# EAGLE design Side_1P (EAGLE 9.6.2)
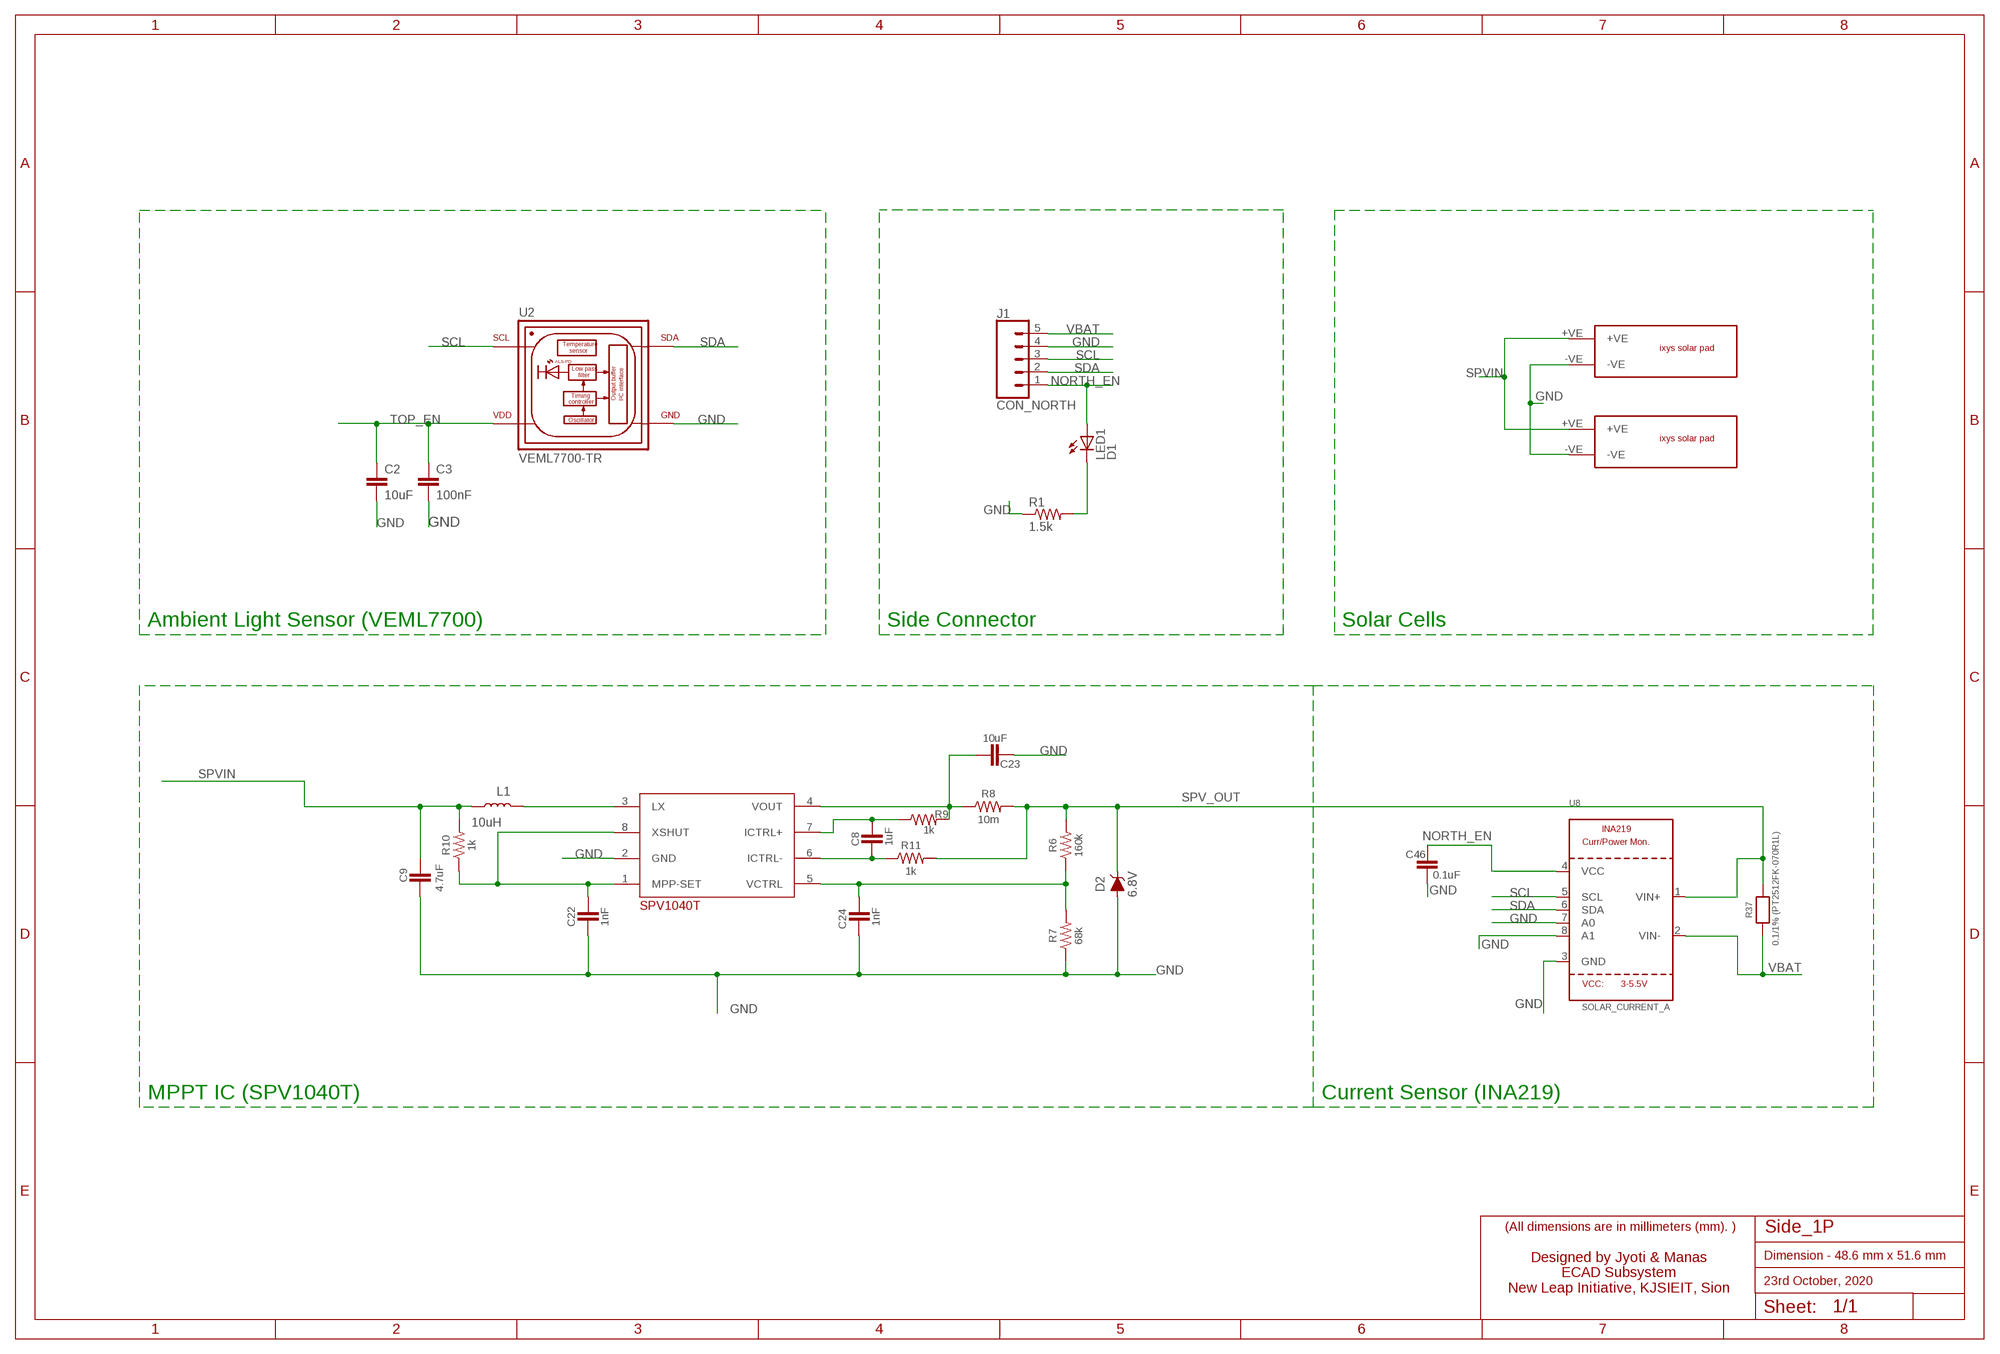
[diagram p0: schematic, sheet 1]

## Parts
C2  10uF  2.2NF/2200PF-0603-50V-10%  [0603]
C3  100nF  2.2NF/2200PF-0603-50V-10%  [0603]
C8  1uF  10UF-0603-6.3V-20%  [0603]
C9  4.7uF  10UF-0603-6.3V-20%  [0603]
C22  1nF  10UF-0603-6.3V-20%  [0603]
C23  10uF  10UF-0603-6.3V-20%  [0603]
C24  1nF  10UF-0603-6.3V-20%  [0603]
C46  0.1uF  10UF-0603-6.3V-20%  [0603]
D2  6.8V  DIODE-ZENER-MMSZ5232BS  [SOD-323]
J1  CON_NORTH  CONN_051.27MM  [1X05_1.27MM]
L1  10uH  INDUCTOR-0603-33NH  [0603]
LED1  D1  LEDCHIP-LED0603  [CHIP-LED0603]
R1  1.5k  R-US_R0603  [R0603]
R6  160k  RC0603JR-070RL  [RES_0603]
R7  68k  RC0603JR-070RL  [RES_0603]
R8  10m  RC0603JR-070RL  [RES_0603]
R9  1k  RC0603JR-070RL  [RES_0603]
R10  1k  RC0603JR-070RL  [RES_0603]
R11  1k  RC0603JR-070RL  [RES_0603]
R37  0.1/1% (PT2512FK-070R1L)  RESISTOR2512  [2512]
SPV_A  SPV1040T_  [SOP65P640X120-8N]
U2  VEML7700-TR  [XDCR_VEML7700-TR]
U8  SOLAR_CURRENT_A  INA219  [SOT23-8]
U$1  IXYS  [IXYS]
U$2  IXYS  [IXYS]

## Nets
GND [vcc]: C2.2 C3.2 C9.2 C22.2 C23.2 C24.2 C46.2 D2.A J1.4 R1.1 R7.1 SPV_A.2(GND) U2.3(GND) U8.3(GND) U8.7(A0) U8.8(A1) U$1.-VE U$2.-VE
N$1: LED1.C R1.2
N$5: L1.2 SPV_A.3(LX)
N$31: C22.1 R10.1 SPV_A.1(MPP-SET) SPV_A.8(XSHUT)
N$32: C24.1 R6.1 R7.2 SPV_A.5(VCTRL)
N$34: C8.2 R11.1 SPV_A.6(ICTRL-)
N$35: C8.1 R9.1 SPV_A.7(ICTRL+)
N$36: C23.1 R8.1 R9.2 SPV_A.4(VOUT)
NORTH_EN: C46.1 J1.1 LED1.A U8.4(VCC)
SCL: J1.3 U2.1(SCL) U8.5(SCL)
SDA: J1.2 U2.4(SDA) U8.6(SDA)
SPV_OUT: D2.C R6.2 R8.2 R11.2 R37.2 U8.1(VIN+)
SPVIN: C9.1 L1.1 R10.2 U$1.+VE U$2.+VE
TOP_EN: C2.1 C3.1 U2.2(VDD)
VBAT: J1.5 R37.1 U8.2(VIN-)

## Notes on the sheet
- Ambient Light Sensor (VEML7700) | Side Connector | Solar Cells
- MPPT IC (SPV1040T) | Current Sensor (INA219)
- (All dimensions are in millimeters (mm). )
- Dimension - 48.6 mm x 51.6 mm
- Designed by Jyoti & Manas
  ECAD Subsystem
  New Leap Initiative, KJSIEIT, Sion
- 23rd October, 2020

## Library data of the parts
C2 C3 = SparkFun-Capacitors:2.2NF/2200PF: 2.2nF/2,200pF ceramic capacitors A capacitor is a passive two-terminal electrical component used to store electrical energy temporarily in an electric field.; PROD_ID: CAP-07877; VALUE: 2.2nF
C8 C9 C22 C24 C46 = SparkFun-Capacitors:10UF: 10.0µF ceramic capacitors A capacitor is a passive two-terminal electrical component used to store electrical energy temporarily in an electric field.; PROD_ID: CAP-11015; VALUE: 10uF
C23 = SparkFun-Capacitors:10UF: 10.0µF ceramic capacitors A capacitor is a passive two-terminal electrical component used to store electrical energy temporarily in an electric field.; PROD_ID: CAP-11015
D2 = SparkFun-DiscreteSemi:DIODE-ZENER: Zener Diode A Zener diode allows current to flow from its anode to its cathode like a normal semiconductor diode, but it also permits current to flow in the reverse direction when its "Zener voltage" is reached. - WIkipedia; PROD_ID: DIO-12442; VALUE: 5.6V
J1 = SparkFun-Connectors:CONN_05: Multi connection point. Often used as Generic Header-pin footprint for 0.1 inch spaced/style header connections On any of the 0.1 inch spaced packages, you can populate with these: Break Away Headers - Straight <https://www.sparkfun.com/products/116> (PRT-00116) Break Away Male Headers - Right Angle <https://www.sparkfun.com/products/553> (PRT-00553) Female Headers <https://www.sparkfun.com/products/115> (PRT-00115) Break Away Headers - Machine Pin <https://www.sparkfun.com/products/117> (PRT-00117) Break Away Female Headers - Swiss Machine Pin <https://www.sparkfun.com/products/743> (PRT-00743) For SCREWTERMINALS and SPRING TERMINALS visit here: Screw Terimnals on SparkFun.com <https://www.sparkfun.com/search/results?term=Screw+Terminals> (5mm/3.5mm/2.54mm spacing) This device is also useful as a general connection point to wire up your design to another part of your project. Our various solder wires solder well into these plated through hole pads. Hook-Up Wire - Assortment (Stranded, 22 AWG) <https://www.sparkfun.com/products/11375> (PRT-11375) Hook-Up Wire - Assortment (Solid Core, 22 AWG) <https://www.sparkfun.com/products/11367> (PRT-11367) View the entire wire category on our website here <https://www.sparkfun.com/categories/141> Special notes: Molex polarized connector foot print use with SKU : PRT-08231 with associated crimp pins and housings. 1MM SMD Version SKU: PRT-10208
L1 = SparkFun-Coils:INDUCTOR: Inductors Resist changes in electrical current. Basically a coil of wire. SparkFun Products: SparkFun Load Cell Amplifier - HX711 <https://www.sparkfun.com/products/13879> IOIO-OTG - V2.2 <https://www.sparkfun.com/products/13613>; PROD_ID: NDUC-07874; VALUE: 33nH/±5%/500mA
LED1 = adafruit:LED: LED OSRAM: - CHIPLED LG R971, LG N971, LY N971, LG Q971, LY Q971, LO R971, LY R971 LH N974, LH R974 LS Q976, LO Q976, LY Q976 LO Q996 - Hyper CHIPLED LW Q18S LB Q993, LB Q99A, LB R99A - SideLED LS A670, LO A670, LY A670, LG A670, LP A670 LB A673, LV A673, LT A673, LW A673 LH A674 LY A675 LS A676, LA A676, LO A676, LY A676, LW A676 LS A679, LY A679, LG A679 - Hyper Micro SIDELED® LS Y876, LA Y876, LO Y876, LY Y876 LT Y87S - SmartLED LW L88C, LW L88S LB L89C, LB L89S, LG L890 LS L89K, LO L89K, LY L89K LS L896, LA L896, LO L896, LY L896 - TOPLED LS T670, LO T670, LY T670, LG T670, LP T670 LSG T670, LSP T670, LSY T670, LOP T670, LYG T670 LG T671, LOG T671, LSG T671 LB T673, LV T673, LT T673, LW T673 LH T674 LS T676, LA T676, LO T676, LY T676, LB T676, LH T676, LSB T676, LW T676 LB T67C, LV T67C, LT T67C, LS T67K, LO T67K, LY T67K, LW E67C LS E67B, LA E67B, LO E67B, LY E67B, LB E67C, LV E67C, LT E67C LW T67C LS T679, LY T679, LG T679 LS T770, LO T770, LY T770, LG T770, LP T770 LB T773, LV T773, LT T773, LW T773 LH T774 LS E675, LA E675, LY E675, LS T675 LS T776, LA T776, LO T776, LY T776, LB T776 LHGB T686 LT T68C, LB T68C - Hyper Mini TOPLED® LB M676 - Mini TOPLED Santana® LG M470 LS M47K, LO M47K, LY M47K Source: http://www.osram.convergy.de/
R1 = adafruit:R-US_: RESISTOR, American symbol
R6-R11 = Resistor_Capacitor:RC0603JR-070RL: RES SMD 0 OHM JUMPER 1/10W 0603 Manufacturer's datasheet <http://www.yageo.com/documents/recent/PYu-RC_Group_51_RoHS_L_10.pdf>; CREATED_BY: PCBLayout.com; DIGIKEY_PART_NUMBER: 311-0.0GRTR-ND; MANUFACTURER: Yageo; MPN: RC0603JR-070RL; PACKAGE: SMD 0603
R37 = microbuilder:RESISTOR: Resistors 0402 - 0402 Surface Mount Package 22 Ohm 1% 1/16W [Digikey: 311-22.0LRTR-ND] 33 Ohm 5% 1/16W 1.0K 5% 1/16W 1.5K 5% 1/16W 2.0K 1% 1/16W 10.0K 1% 1/16W [Digikey: 311-10.0KLRTR-ND] 10.0K 5% 1/16W [Digikey: RMCF0402JT10K0TR-ND] 12.1K 1% 1/16W [Digikey: 311-22.0LRTR-ND] 100.0K 5% 1/16W 0603 - 0603 Surface Mount Package 0 Ohm 1/10 Watt 1% Resistor 15 Ohm 1/10 Watt 1% Resistor 33 Ohm 1/10 Watt 1% Resistor 49.9 Ohm 1/10 Watt 1% Resistor 100 Ohm 1/10 Watt 1% Resistor 150 Ohm 1/10 Watt 1% Resistor 240 Ohm 1/10 Watt 1% Resistor 390 Ohm 1/10 Watt 1% Resistor 560 Ohm 1/10 Watt 1% Resistor 680 Ohm 1/10 Watt 1% Resistor 750 Ohm 1/10 Watt 1% Resistor 1.0K Ohm 1/10 Watt 1% Resistor 1.5K Ohm 1/10 Watt 1% Resistor 2.0K Ohm 1/10 Watt 1% Resistor 2.2K Ohm 1/10 Watt 1% Resistor 3.3K Ohm 1/10 Watt 1% Resistor 4.7K Ohm 1/10 Watt 1% Resistor 10.0K Ohm 1/10 Watt 1% Resistor 12.0K Ohm 1/10 Watt 1% Resistor 12.1K Ohm 1/10 Watt 1% Resistor 20.0K Ohm 1/10 Watt 1% Resistor 33.0K Ohm 1/10 Watt 1% Resistor 100.0K Ohm 1/10 Watt 1% Resistor 0805 - 0805 Surface Mount Package 0 Ohm 1/8 Watt 1% Resistor 33 Ohm 1/8 Watt 1% Resistor 100 Ohm 1/8 Watt 1% Resistor 150 Ohm 1/8 Watt 1% Resistor 200 Ohm 1/8 Watt 1% Resistor 240 Ohm 1/8 Watt 1% Resistor 330 Ohm 1/8 Watt 1% Resistor 390 Ohm 1/8 Watt 1% Resistor 470 Ohm 1/8 Watt 1% Resistor 1.0K Ohm 1/8 Watt 1% Resistor 1.5K Ohm 1/8 Watt 1% Resistor 2.0K Ohm 1/8 Watt 1% Resistor 4.7K Ohm 1/8 Watt 1% Resistor 5.1K Ohm 1/8 Watt 1% Resistor 5.6K Ohm 1/8 Watt 1% Resistor 10.0K Ohm 1/8 Watt 1% Resistor 22.0K Ohm 1/8 Watt 1% Resistor 33.0K Ohm 1/8 Watt 1% Resistor 100K Ohm 1/8 Watt 1% Resistor 1206 - 1206 Surface Mount Package 2012 - 2010 Surface Mount Package 0.11 Ohm 1/2 Watt 1% Resistor - Digikey: RHM.11UCT-ND
SPV_A = SPV1040T:SPV1040T_
U2 = VEML7700-TR:VEML7700-TR: Light to Digital Ambient Light Sensor Digital 0lux to 167000lux 8-Pin SMD T/R; ARROW_ELECTRONICS-PURCHASE-URL: https://snapeda.com/shop?store=Arrow+Electronics&id=620383; DESCRIPTION: Optical Sensor Ambient 545nm I²C 4-SMD, J-Lead; DIGI-KEY_PART_NUMBER: VEML7700CT-ND; DIGIKEY-PURCHASE-URL: https://snapeda.com/shop?store=DigiKey&id=620383; MF: Vishay; MOUSER-PURCHASE-URL: https://snapeda.com/shop?store=Mouser&id=620383; MP: VEML7700-TR; PACKAGE: SMD-4 Vishay
U8 = microbuilder:INA219: INA219 - I2C Current/Power Monitor Voltage Range: 0-26V Accuracy: 0.5% Temperature: -40°C - 125°C
U$1 U$2 = ixys:IXYS

## Net classes
1 vcc: width 0.254 mm

## Board
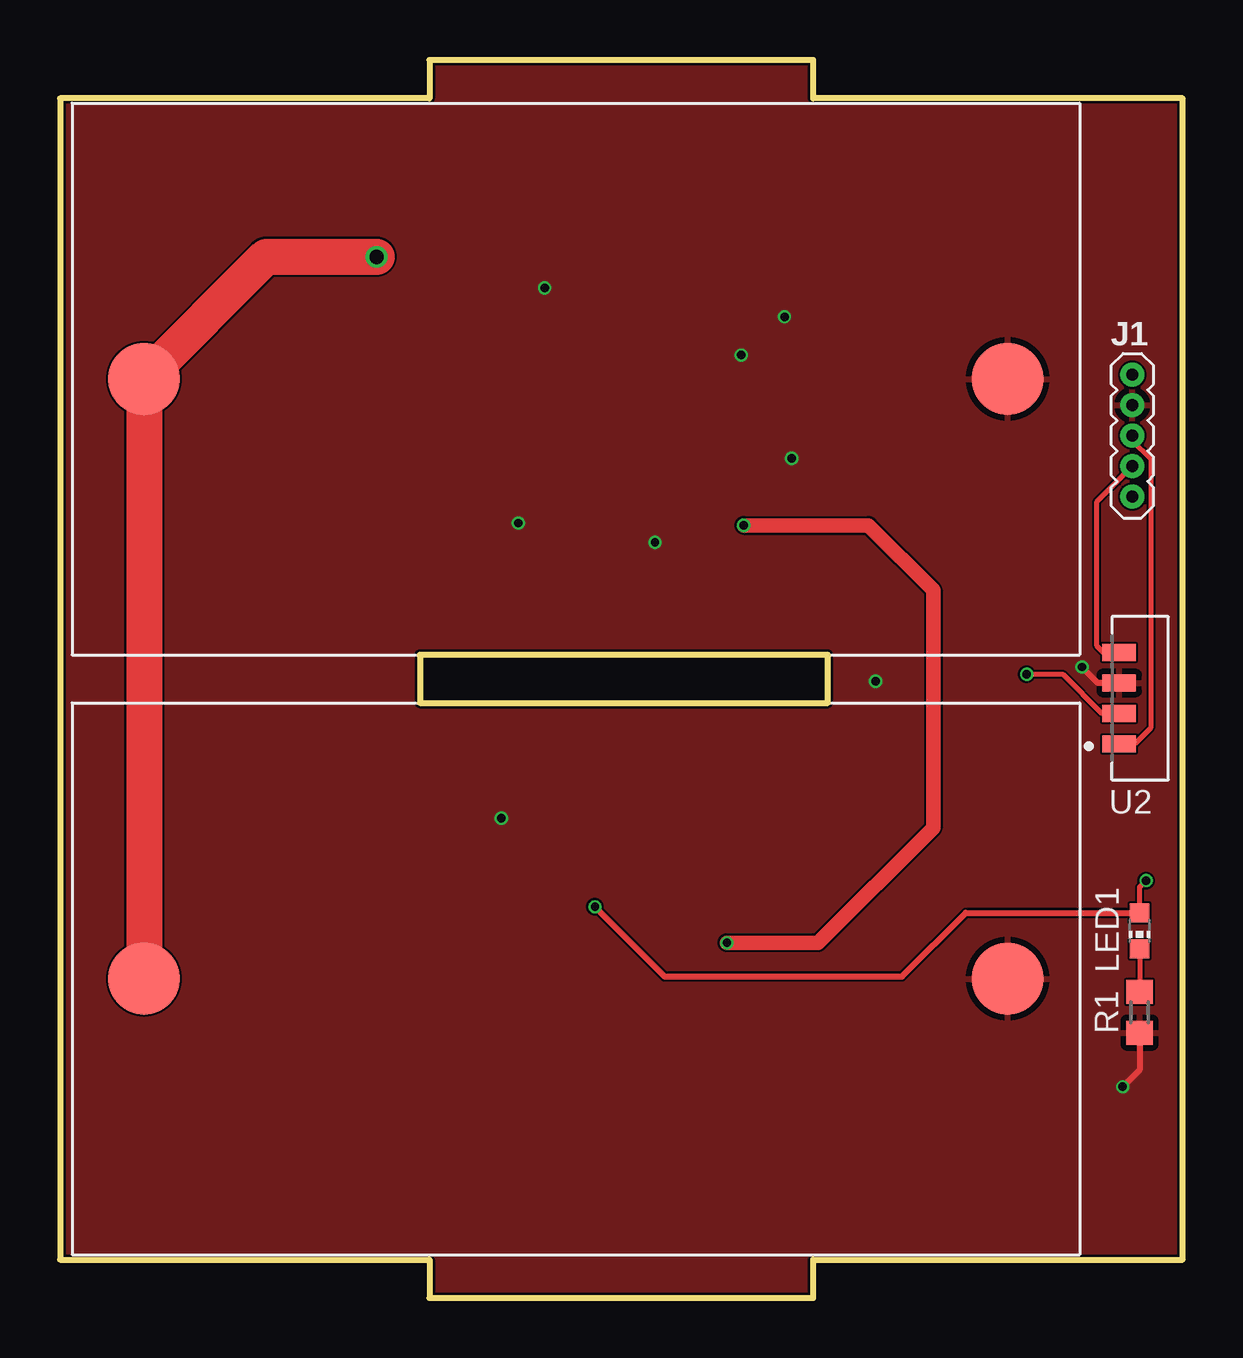
[diagram p1: board, top side]
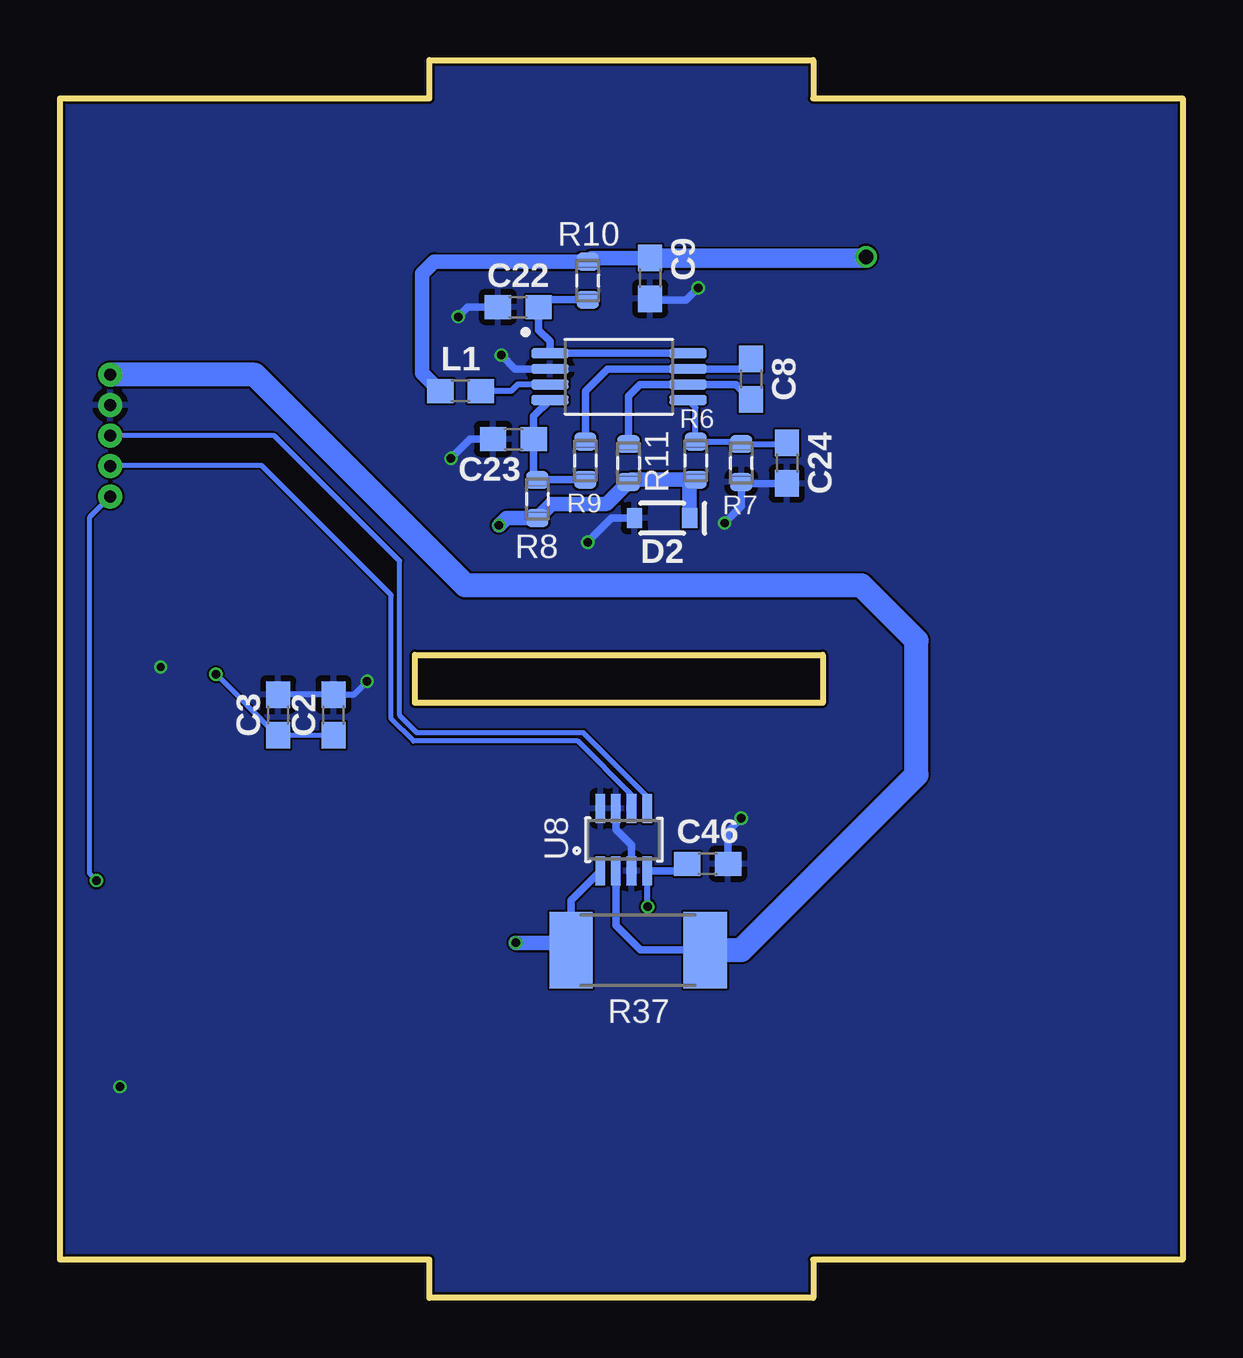
[diagram p2: board, bottom side, seen from below]

Size 46.8 x 51.6 mm. Coordinates in mm from the lower left corner, seen from the top.
Outline: 0,1.6 15.4,1.6 15.4,0 31.4,0 31.4,1.6 46.8,1.6 46.8,50 31.4,50 31.4,51.6 15.4,51.6 15.4,50 0,50 0,1.6
Outline: 15,24.8 32,24.8 32,26.8 15,26.8 15,24.8
Copper layers (1*16): Top 0.035mm / dielectric 0.2mm / Bottom 0.035mm
Design rules "jlcpcb-2-layer": minimum track width 3.5mil, minimum drill 0.2mm, track to track 3.5mil, track to pad 5mil, pad to pad 5mil, via to via 5mil, smd to smd 0mil, copper to edge 0.1mm, drill to drill 5mil, minimum pad ring 4mil, minimum via ring 4mil, stop-mask expansion 3mil, vias tented up to drill 100mil, thermal gap 10mil

### Footprints (pad centres in the part's own frame; a part is rotated, then mirrored left to right if it is on the bottom)
0603 = smd 1.1 x 1: 1 -0.85,0; 2 0.85,0
SOD-323 = smd 0.63 x 0.83: A 1.15,0; C -1.15,0
1X05_1.27MM = drill 0.508 pad 1: 1 0,0; 2 1.27,0; 3 2.54,0; 4 3.81,0; 5 5.08,0
CHIP-LED0603 = smd 0.8 x 0.8: A 0,-0.75; C 0,0.75
R0603 = smd 1 x 1.1: 1 -0.85,0; 2 0.85,0
RES_0603 = smd 0.74 x 0.93: 1 -0.795,0; 2 0.795,0
2512 = smd 1.8 x 3.2: 1 -2.8,0; 2 2.8,0
SOP65P640X120-8N = smd 1.56 x 0.41: 1 -2.88,0.975; 2 -2.88,0.325; 3 -2.88,-0.325; 4 -2.88,-0.975; 5 2.88,-0.975; 6 2.88,-0.325; 7 2.88,0.325; 8 2.88,0.975
XDCR_VEML7700-TR = smd 1.4 x 0.7: 1 0.55,1.905; 2 0.55,0.635; 3 0.55,-0.635; 4 0.55,-1.905
SOT23-8 = smd 0.4 x 1.2: 1 -0.975,-1.3; 2 -0.325,-1.3; 3 0.325,-1.3; 4 0.975,-1.3; 5 0.975,1.3; 6 0.325,1.3; 7 -0.325,1.3; 8 -0.975,1.3
IXYS = smd 3 x 3: +VE 3,11.5; -VE 39,11.5

### Placement (x,y rotation side)
C2  35.4,24.3 90 bottom
C3  37.7,24.3 90 bottom
C8  18,38.3 270 bottom
C9  22.2,42.5 270 bottom
C22  27.7,41.3 180 bottom
C23  27.9,35.8 180 bottom
C24  16.5,34.8 270 bottom
C46  19.8,18.1 0 bottom
D2  21.7,32.5 180 bottom
J1  44.7,33.4 90 top
L1  30.1,37.8 0 bottom
LED1  45,15.3 180 top
R1  45,11.9 90 top
R6  20.3,34.9 270 bottom
R7  18.4,34.8 90 bottom
R8  26.9,33.3 270 bottom
R9  24.9,34.9 270 bottom
R10  24.8,42.4 90 bottom
R11  23.1,34.8 270 bottom
R37  22.7,14.5 180 bottom
SPV_A  23.5,38.4 0 bottom
U2  44.7,25 180 top
U8  23.3,19.1 0 bottom
U$1  0.5,26.8 0 top
U$2  0.5,1.8 0 top

### Tracks (layer width: path | path; a pad name or v marks a point on that pad's centre or on a via)
GND  (via drill 0.35)
  Top 0.254: U2.3 43.27,25.64 v42.6,26.3 | R1.1 45,9.5 v44.3,8.8
  Bottom 0.254: C3.2 C2.2 34.55,25.15 v34,25.7
  Bottom 0.305: C23.2 29.7,35.8 v30.5,35 | v19.1,32.3 18.4,33 R7.1 18.34,33.95 C24.2 | D2.A 23.8,32.5 v24.8,31.5 | C9.2 22.15,41.6 20.7,41.6 v20.2,42.1 | C22.2 29.8,41.3 v30.2,40.9 | SPV_A.2 27.82,38.73 v28.4,39.3 | U8.3 22.98,18.88 23.62,19.53 U8.7 | C46.2 18.95,19.45 v18.4,20
  pour Top: -7.6,-0.9 -7.6,56.4 54.8,56.4 54.8,-2.1 -7.6,-2.1
  pour Bottom: -7.6,-2.1 -7.6,56.4 54.8,56.4 54.8,-2.1
N$1
  Top 0.2: LED1.C R1.2
N$5
  Bottom 0.254: SPV_A.3 27.73,38.08 28,37.8 L1.2
N$31
  Bottom 0.305: R10.1 26.55,41.61 C22.1 26.85,40.35 26.38,39.88 SPV_A.1 SPV_A.8
N$32
  Bottom 0.254: SPV_A.5 20.3,37.11 R6.1 18.5,35.7 R7.2 16.55,35.59 C24.1
N$34
  Bottom 0.305: C8.2 18.62,38.08 SPV_A.6 22.62,38.08 23.1,37.6 R11.1
N$35
  Bottom 0.305: C8.1 18.43,38.73 SPV_A.7 23.98,38.73 24.9,37.8 R9.1
N$36
  Bottom 0.305: SPV_A.4 27.05,36.76 C23.1 27.05,34.27 26.89,34.11 | R9.2 26.89,34.11 | 26.89,34.11 R8.1
NORTH_EN  (via drill 0.35)
  Top 0.2: LED1.A 45,17.12 v45.28,17.4
  Top 0.254: v22.3,16.3 25.2,13.4 35.1,13.4 37.75,16.05 LED1.A
  Bottom 0.2: v45.28,17.4 45.56,17.68 45.56,32.54 J1.1
  Bottom 0.254: U8.4 22.32,16.32 v22.3,16.3
  Bottom 0.305: C46.1 20.95,17.8 U8.4
SCL
  Top 0.2: J1.3 44.7,35.75 45.46,34.98 45.46,23.76 44.8,23.1 U2.1
  Bottom 0.2: J1.3 37.87,35.94 32.64,30.72 32.64,24.29 31.91,23.56 24.98,23.56 22.32,20.91 U8.5
SDA
  Top 0.2: J1.2 43.2,33.17 43.2,27.2 43.49,26.91 U2.4
  Bottom 0.2: U8.6 22.98,20.98 25.2,23.21 32.06,23.21 32.99,24.14 32.99,29.3 38.4,34.7 44.67,34.7 J1.2
SPV_OUT  (via drill 0.35)
  Top 0.61: v28.5,32.2 33.7,32.2 36.4,29.5 36.4,19.6 31.6,14.8 v27.8,14.8
  Bottom 0.305: U8.1 25.5,16.57 25.5,14.8 R37.2
  Bottom 0.61: D2.C 20.55,33.86 R6.2 23,34.11 R11.2 24,33.11 24.05,33.11 24.06,33.1 26.3,33.1 R8.2 28.2,32.51 v28.5,32.2 | v27.8,14.8 25.5,14.8
SPVIN  (via drill 0.6)
  Top 1.5: U$2.+VE U$1.+VE 8.6,43.4 v13.2,43.4
  Bottom 0.61: L1.1 31.7,38.55 31.7,42.7 31.2,43.2 R10.2 24.64,43.35 C9.1
  Bottom 0.813: C9.1 13.25,43.35 v13.2,43.4
TOP_EN  (via drill 0.35)
  Top 0.2: v40.3,26 41.8,26 43.44,24.37 U2.2
  Bottom 0.2: C2.1 C3.1 37.75,23.45 v40.3,26
VBAT
  Bottom 0.305: R37.1 22.6,14.5 23.62,15.53 U8.2
  Bottom 1: R37.1 18.4,14.5 11.1,21.8 11.1,27.4 13.4,29.7 29.9,29.7 38.68,38.48 J1.5